# EasyEDA schematic SCH_Tubeamppedal_2023-07-10.json
TITLE: Tube Amplification Pedal; REV: 1.0; Date: 2023-06-27; Sheet: 1/1; Drawn By: Rishi Nandha V
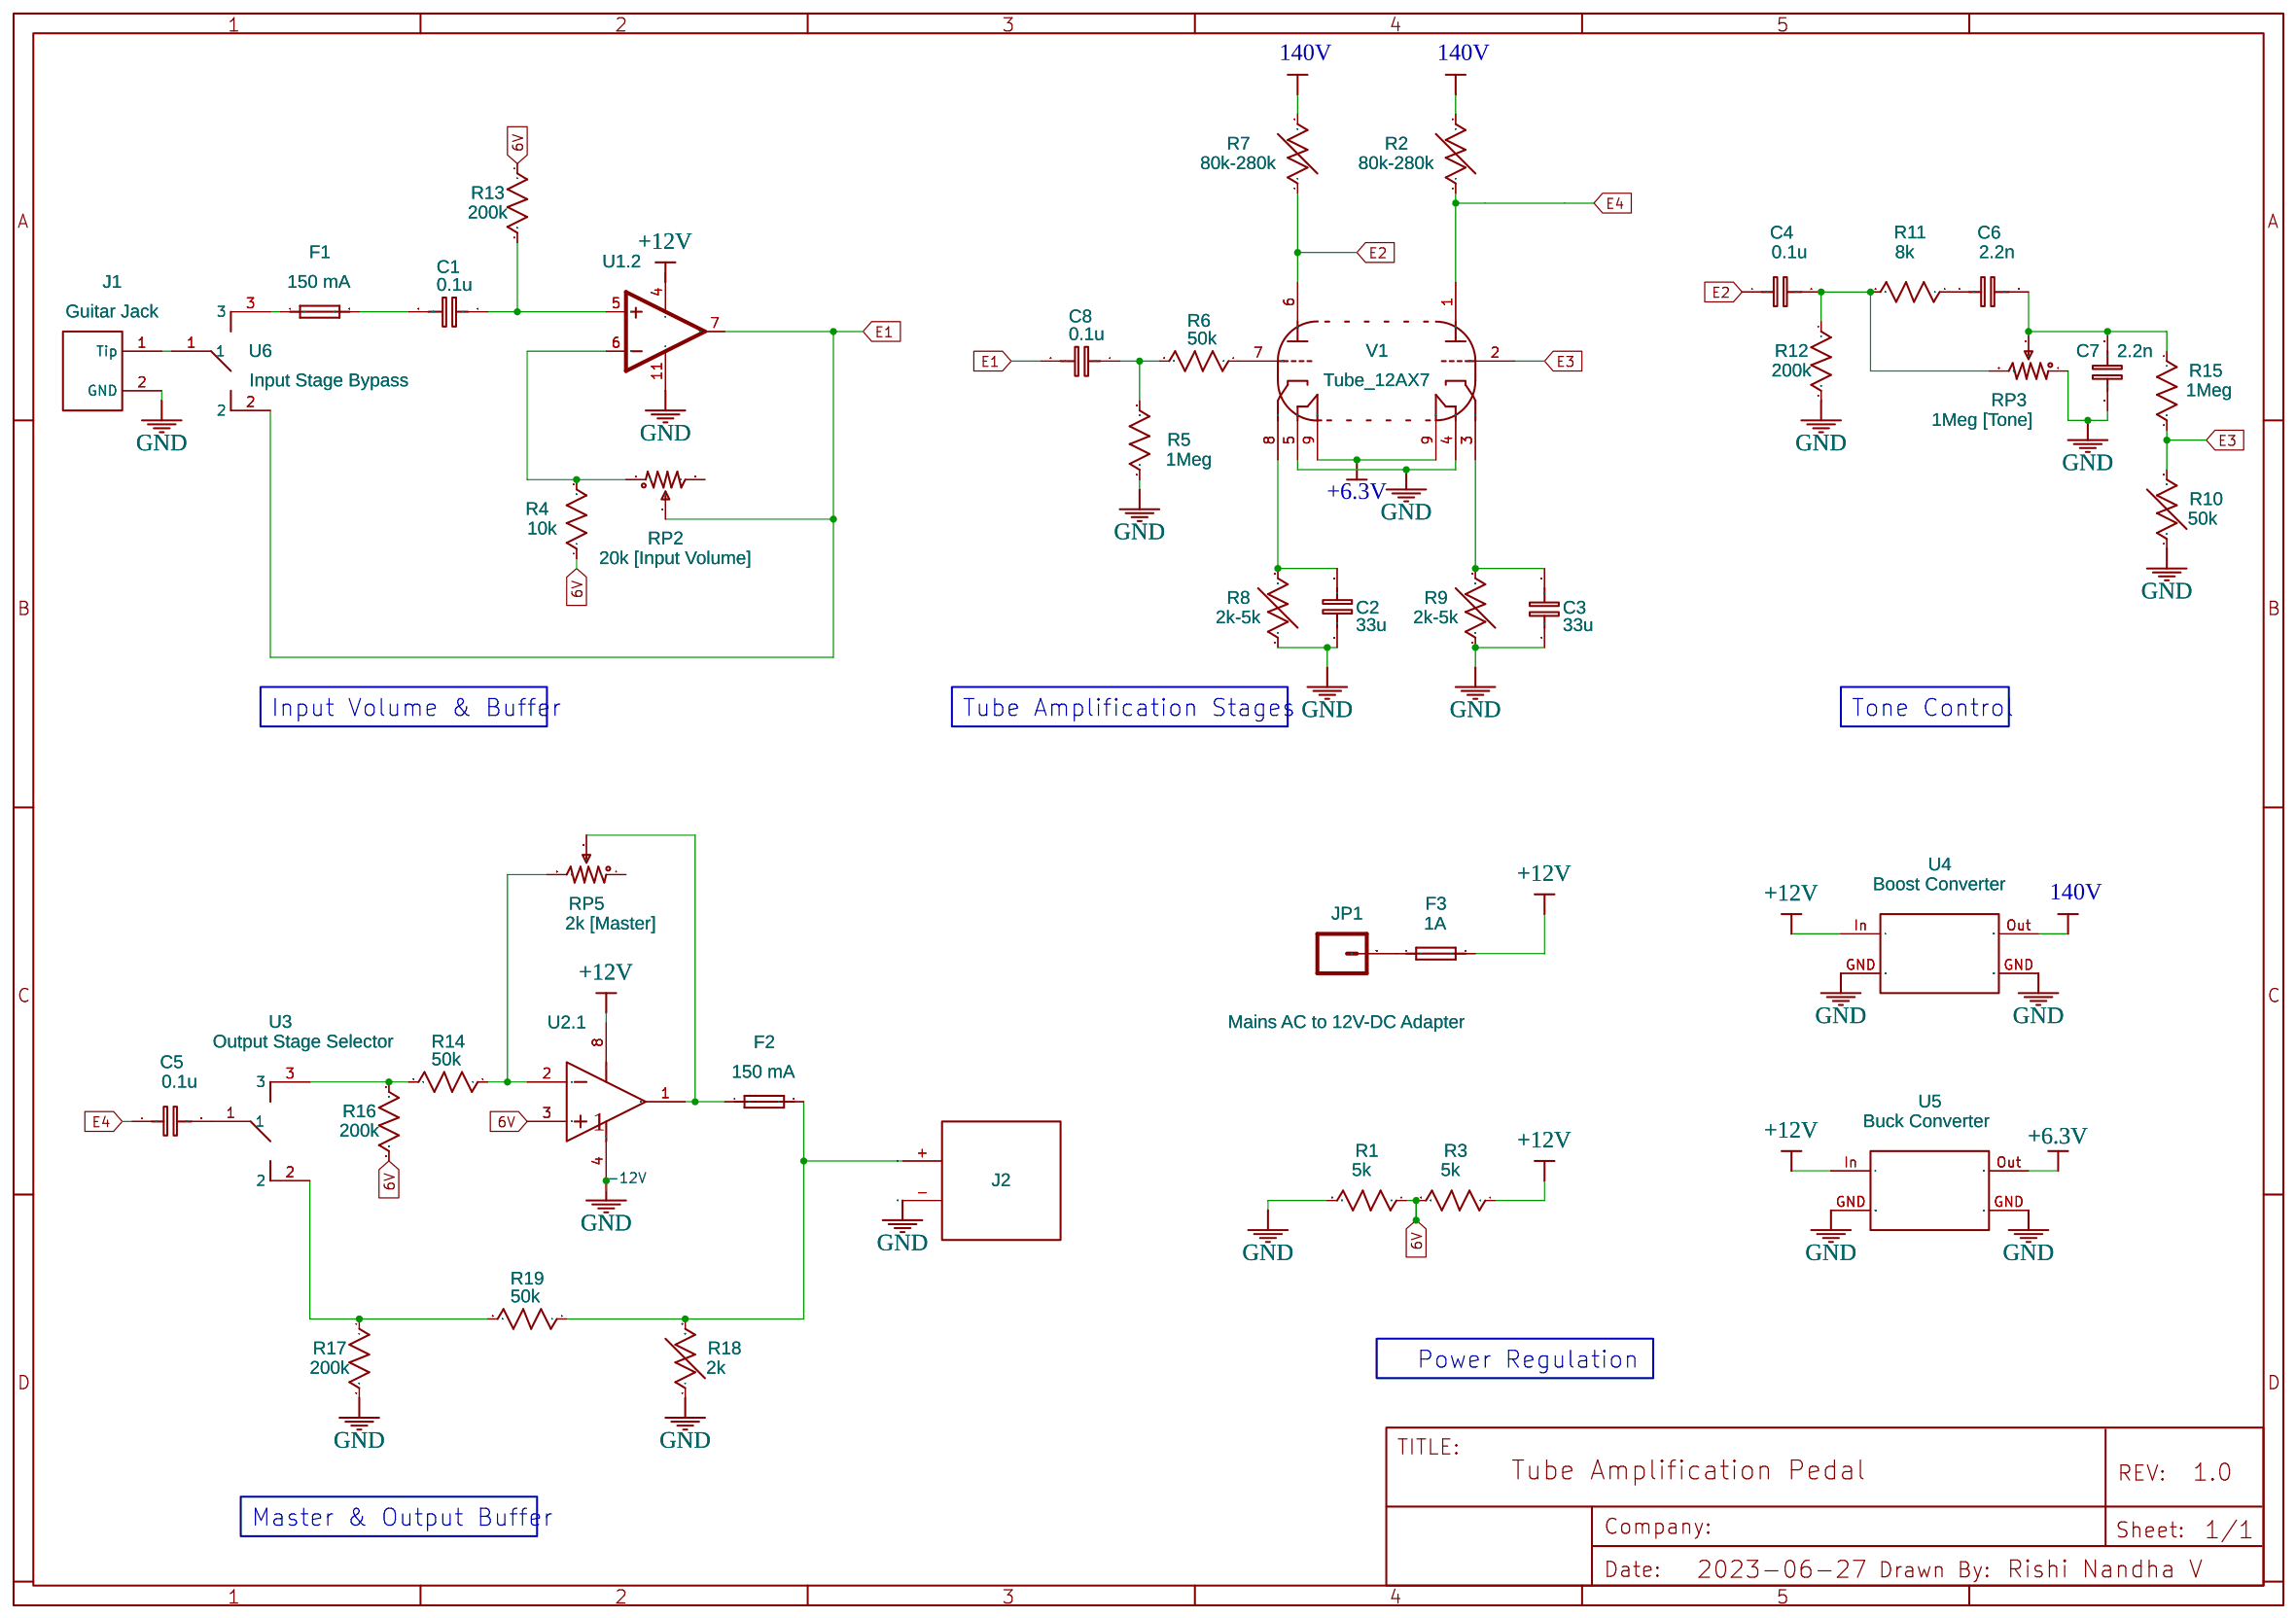
[diagram p0: schematic sheet]

## Parts
C1  0.1u  [C0603]
C2  33u  [C0603]
C3  33u  [C0603]
C4  0.1u  [C0603]
C5  0.1u  [C0603]
C6  2.2n  [C0603]
C7  2.2n  [C0603]
C8  0.1u  [C0603]
F1  150 mA  [NANO2_SMF_FUSE]
F2  150 mA  [NANO2_SMF_FUSE]
F3  1A  [NANO2_SMF_FUSE]
J1  Guitar Jack  [GUITAR JACK]
J2  Guitar_Jack_Output  [GUITAR_JACK_OUTPUT]
JP1  Mains AC to 12V-DC Adapter  [SPRING-CONNECTOR]
R1  5k  [R0603]
R2  80k-280k  [AXIAL-0.3]
R3  5k  [R0603]
R4  10k  [R0603]
R5  1Meg  [R0603]
R6  50k  [R0603]
R7  80k-280k  [AXIAL-0.3]
R8  2k-5k  [AXIAL-0.3]
R9  2k-5k  [AXIAL-0.3]
R10  50k  [AXIAL-0.3]
R11  8k  [R0603]
R12  200k  [R0603]
R13  200k  [R0603]
R14  50k  [R0603]
R15  1Meg  [R0603]
R16  200k  [R0603]
R17  200k  [R0603]
R18  2k  [AXIAL-0.3]
R19  50k  [R0603]
RP2  20k [Input Volume]  [RES-ADJ-TH_3386P]
RP3  1Meg [Tone]  [RES-ADJ-TH_3386P]
RP5  2k [Master]  [RES-ADJ-TH_3386P]
U1  ADA4851-4  [TSSOP-14]  (section 2)
U2  HA7-5102-2  [DIP8]  (section 1)
U3  Output Stage Selector
U4  Boost Converter  [SOT-223]
U5  Buck Converter  [SOT-223]
U6  Input Stage Bypass
V1  Tube_12AX7  [12AX7]

## Library data of the parts
C1-C8 = C_0603_EU: Contributor: LCEDA_Lib
F1-F3 = NANO2SMF_R452.500L
J1 = Guitar Jack: Contributor: Jose Tovar
J2 = Guitar_Jack_Output: Contributor: ahmits; Package Display: No
JP1 = M01: Contributor: SparkFun
R1 R3-R6 R11-R17 R19 = R_0603_US: Contributor: LCEDA_Lib
R2 R7-R10 R18 = RHEOSTAT
RP2 RP3 RP5 = R_3386P_US: Supplier: LCSC; Contributor: LCEDA_Lib; value(Ω): 10K
U1 = ADA4851-4: subpart_no: 2
U2 = HA7-5102-2: Low Noise Operational Amplifier; subpart_no: 1
U3 U6 = Art_TWO-WAY_SWITCH: Manufacturer Part: TWO-WAY SWITCH; Contributor: Arczii
U4 U5 = LM1117IMPX-ADJNOPB: 800mA Low-Dropout Linear Regulator, 4-pin SOT-223, Pb-Free
V1 = Tube_12AX7: High Mu Dual Triode; Contributor: prvi sedmi

## Nets
6V: R1.1 R3.2 R4.1 R13.1 R16.2 U2.3(IN+)
140V: R2.2 R7.2 U4.Out(OUT)
+6.3V: U5.Out(OUT) V1.9(HM)
+12V: F3.2 R3.1 U1.4(V+) U2.8(V+) U4.In(IN) U5.In(IN)
-12V: C2.2 C3.1 C7.1 J1.2(GND) R1.2 R5.1 R8.1 R9.1 R10.1 R12.2 R17.2 R18.1 RP3.1 U1.11(V-) U2.4(V-) U4.GND(TAB) U5.GND(TAB) V1.4(H) V1.5(H)
E1: C8.2 RP2.2 U1.7(OUT) U6.2
E2: C4.1 R7.1 V1.6(PT2)
E3: R10.2 R15.2 V1.2(GT1)
E4: C5.1 R2.1 V1.1(PT1)
Net-(C1-1): C1.1 R13.2 U1.5(+IN)
Net-(C1-2): C1.2 F1.2
Net-(C2-1): C2.1 R8.2 V1.8(KT2)
Net-(C3-2): C3.2 R9.2 V1.3(KT1)
Net-(C4-2): C4.2 R11.2 R12.1 RP3.3
Net-(C5-2): C5.2 U3.1
Net-(C6-1): C6.1 R11.1
Net-(C6-2): C6.2 C7.2 R15.1 RP3.2
Net-(C8-1): C8.1 R5.2 R6.2
Net-(F1-1): F1.1 U6.3
Net-(F2-1): F2.1 RP5.2 U2.1(OUT)
Net-(F2-2): F2.2 R18.2 R19.1
Net-(F3-1): F3.1 JP1.P$2(1)
Net-(J1-1): J1.1(Tip) U6.1
Net-(R4-2): R4.2 RP2.1 U1.6(-IN)
Net-(R6-1): R6.1 V1.7(GT2)
Net-(R14-1): R14.1 RP5.3 U2.2(IN-)
Net-(R14-2): R14.2 R16.1 U3.3
Net-(R17-1): R17.1 R19.2 U3.2

Not connected (* = marked no-connect by the designer): J2 +(1) -(2); RP2 3; RP5 1

## Notes on the sheet
- Input Volume & Buffer
- Tube Amplification Stages
- Tone Control
- Power Regulation
- Master & Output Buffer
